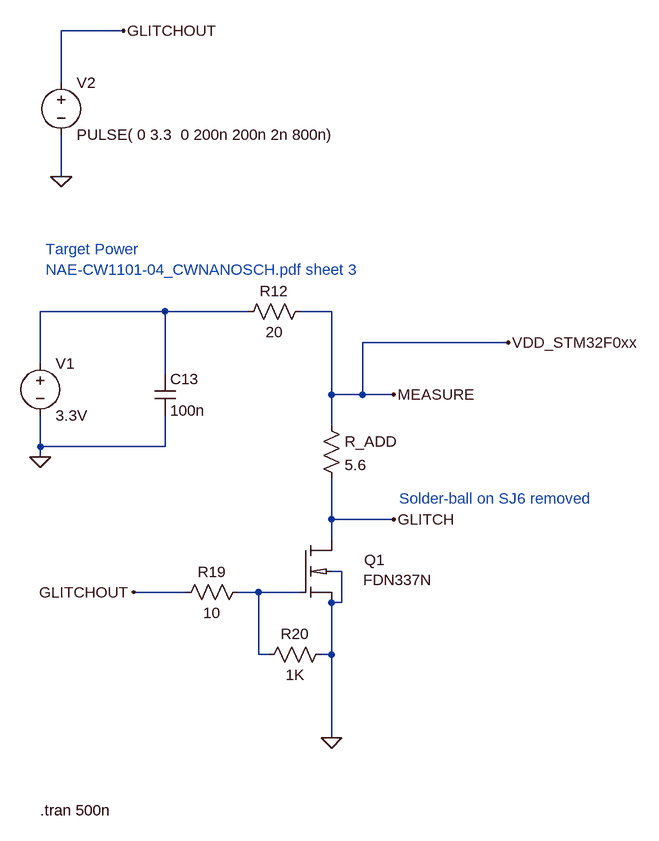
[diagram p0: schematic cw_nano_scucessfull_glitch_sim_fdn337N__Mod_Sim.asc]
cw_nano_scucessfull_glitch_sim_fdn337N__Mod_Sim.asc, the LTspice schematic file:
Version 4
SHEET 1 2692 1140
WIRE -592 -576 -688 -576
WIRE -688 -496 -688 -576
WIRE -688 -352 -688 -416
WIRE -528 -144 -720 -144
WIRE -400 -144 -528 -144
WIRE -272 -144 -320 -144
WIRE 0 -96 -224 -96
WIRE -720 -64 -720 -144
WIRE -528 -48 -528 -144
WIRE -272 -16 -272 -144
WIRE -224 -16 -224 -96
WIRE -224 -16 -272 -16
WIRE -176 -16 -224 -16
WIRE -272 32 -272 -16
WIRE -720 64 -720 16
WIRE -528 64 -528 16
WIRE -528 64 -720 64
WIRE -720 80 -720 64
WIRE -272 176 -272 112
WIRE -176 176 -272 176
WIRE -272 208 -272 176
WIRE -256 256 -272 256
WIRE -496 288 -576 288
WIRE -384 288 -416 288
WIRE -320 288 -384 288
WIRE -256 304 -256 256
WIRE -256 304 -272 304
WIRE -384 384 -384 288
WIRE -368 384 -384 384
WIRE -272 384 -272 304
WIRE -272 384 -288 384
WIRE -272 512 -272 384
FLAG -720 80 0
FLAG -688 -352 0
FLAG -592 -576 GLITCHOUT
FLAG -176 -16 MEASURE
FLAG -272 512 0
FLAG -576 288 GLITCHOUT
FLAG -176 176 GLITCH
FLAG 0 -96 VDD_STM32F0xx
SYMBOL voltage -720 -80 R0
WINDOW 123 0 0 Left 0
WINDOW 39 0 0 Left 0
SYMATTR InstName V1
SYMATTR Value 3.3V
SYMBOL voltage -688 -512 R0
WINDOW 123 0 0 Left 0
WINDOW 39 0 0 Left 0
SYMATTR InstName V2
SYMATTR Value PULSE( 0 3.3  0 200n 200n 2n 800n)
SYMBOL res -272 368 R90
WINDOW 0 0 56 VBottom 2
WINDOW 3 32 56 VTop 2
SYMATTR InstName R20
SYMATTR Value 1K
SYMBOL res -400 272 R90
WINDOW 0 0 56 VBottom 2
WINDOW 3 32 56 VTop 2
SYMATTR InstName R19
SYMATTR Value 10
SYMBOL cap -544 -48 R0
SYMATTR InstName C13
SYMATTR Value 100n
SYMBOL res -304 -160 R90
WINDOW 0 0 56 VBottom 2
WINDOW 3 32 56 VTop 2
SYMATTR InstName R12
SYMATTR Value 20
SYMBOL FDN337N -320 208 R0
WINDOW 0 98 30 Left 2
WINDOW 3 97 61 Left 2
SYMATTR InstName Q1
SYMBOL res -288 16 R0
SYMATTR InstName R_ADD
SYMATTR Value 5.6
TEXT -720 624 Left 2 !.tran 500n
TEXT -712 -240 Left 2 ;Target Power \nNAE-CW1101-04_CWNANOSCH.pdf sheet 3
TEXT -168 144 Left 2 ;Solder-ball on SJ6 removed

The netlist it stands for:
* cw_nano_scucessfull_glitch_sim_fdn337N__Mod_Sim.asc
V1 N001 0 3.3V
V2 GLITCHOUT 0 PULSE( 0 3.3  0 200n 200n 2n 800n)
R20 0 N002 1K
R19 N002 GLITCHOUT 10
C13 N001 0 100n
R12 VDD_STM32F0xx N001 20
XQ1 GLITCH N002 0 0 FDN337N  ; pins D G S B
R_ADD VDD_STM32F0xx GLITCH 5.6
.tran 500n
* Target Power
* NAE-CW1101-04_CWNANOSCH.pdf sheet 3
* Solder-ball on SJ6 removed
.lib FDN337N.lib
.backanno
.end